# EAGLE design board_v1 (EAGLE 9.4.0)
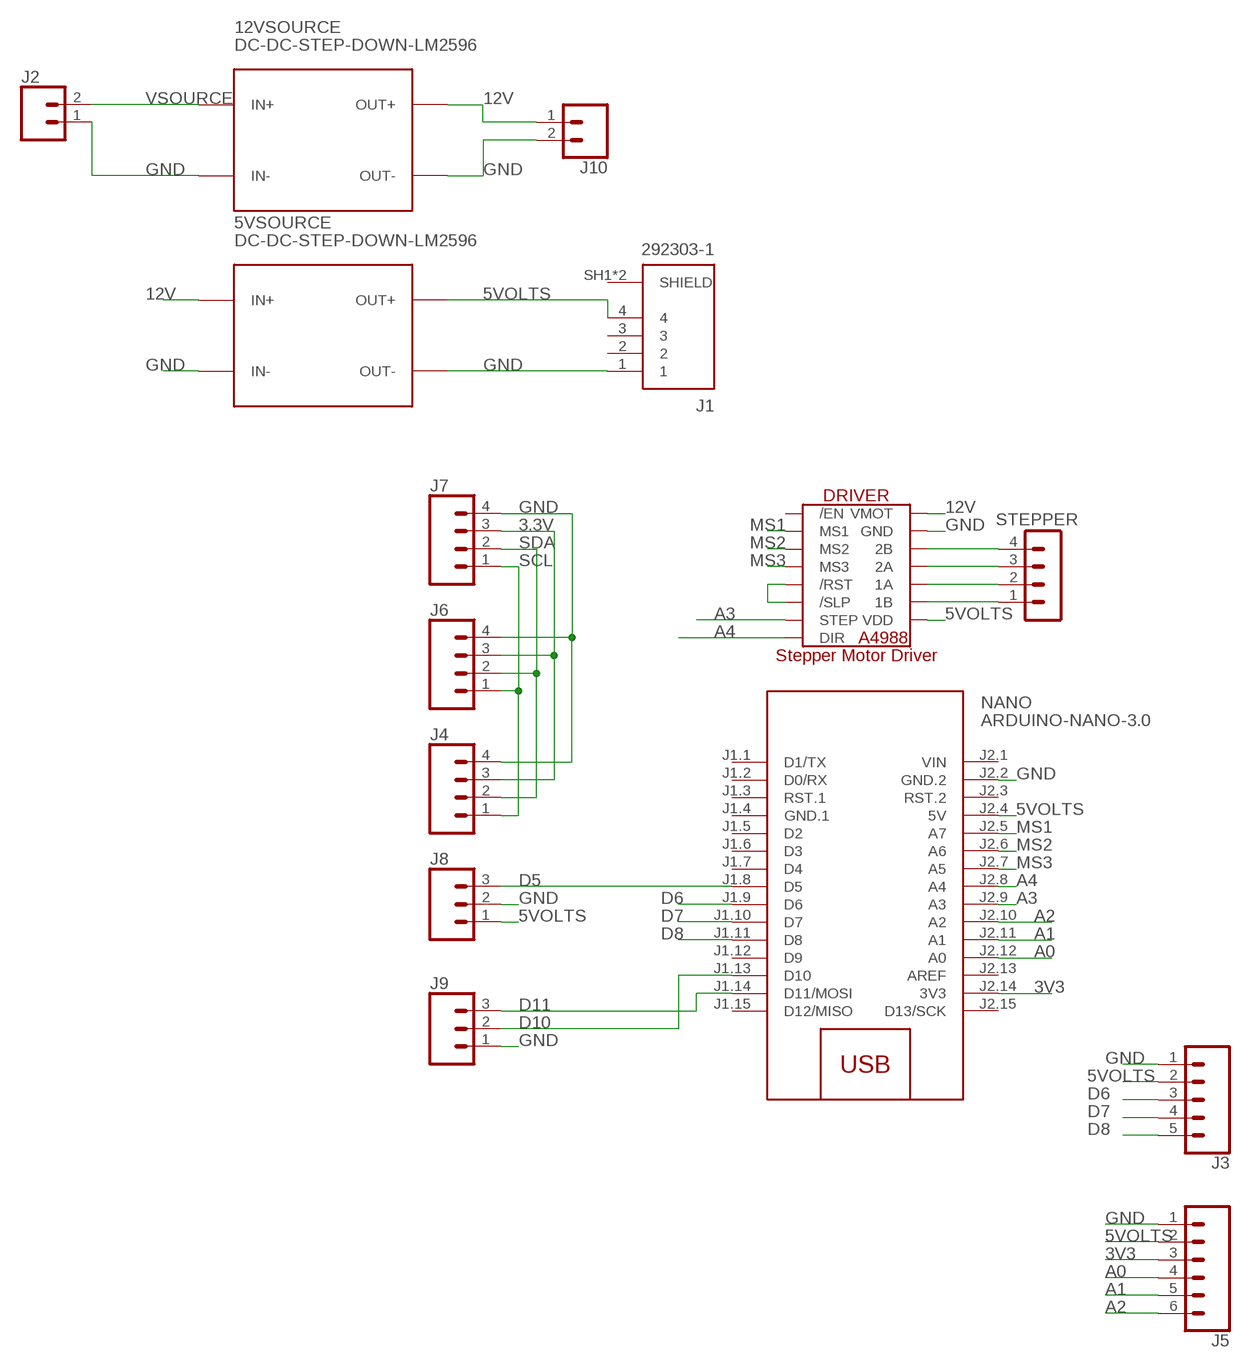
[diagram p0: schematic, sheet 1]

## Parts
5VSOURCE  DC-DC-STEP-DOWN-LM2596  [DC-DC-STEP-DOWN-LM2596]
12VSOURCE  DC-DC-STEP-DOWN-LM2596  [DC-DC-STEP-DOWN-LM2596]
DRIVER  A4988_STEP  [A4988_STEP]
J1  292303-1  [292303-1]
J2  CONN_025MM  [SCREWTERMINAL-5MM-2]
J3  CONN_05  [1X05]
J4  CONN_04POLAR  [MOLEX-1X4]
J5  CONN_06SILK_FEMALE_PTH  [1X06]
J6  CONN_04POLAR  [MOLEX-1X4]
J7  CONN_04POLAR  [MOLEX-1X4]
J8  CONN_03POLAR  [MOLEX-1X3]
J9  CONN_03POLAR  [MOLEX-1X3]
J10  CONN_025MM  [SCREWTERMINAL-5MM-2]
NANO  ARDUINO-NANO-3.0  [ARDUINO-NANO-3.0]
STEPPER  MA04-1  [MA04-1]

## Nets
3.3V: J4.3 J6.3 J7.3
3V3: J5.3 NANO.J2.14(3V3)
5VOLTS: 5VSOURCE.OUT+ DRIVER.VDD J1.4 J3.2 J5.2 J8.1 NANO.J2.4(5V)
12V: 5VSOURCE.IN+ 12VSOURCE.OUT+ DRIVER.VMOT J10.1
A0: J5.4 NANO.J2.12(A0)
A1: J5.5 NANO.J2.11(A1)
A2: J5.6 NANO.J2.10(A2)
A3: DRIVER.STEP NANO.J2.9(A3)
A4: DRIVER.DIR NANO.J2.8(A4)
D5: J8.3 NANO.J1.8(D5)
D6: J3.3 NANO.J1.9(D6)
D7: J3.4 NANO.J1.10(D7)
D8: J3.5 NANO.J1.11(D8)
D10: J9.2 NANO.J1.13(D10)
D11: J9.3 NANO.J1.14(D11/MOSI)
GND: 5VSOURCE.IN- 5VSOURCE.OUT- 12VSOURCE.IN- 12VSOURCE.OUT- DRIVER.GND DRIVER.GND2(GND) J1.1 J2.1 J3.1 J4.4 J5.1 J6.4 J7.4 J8.2 J9.1 J10.2 NANO.J2.2(GND.2)
MS1: DRIVER.MS1 NANO.J2.5(A7)
MS2: DRIVER.MS2 NANO.J2.6(A6)
MS3: DRIVER.MS3 NANO.J2.7(A5)
N$2: DRIVER.2B STEPPER.4
N$6: DRIVER.2A STEPPER.3
N$7: DRIVER.1A STEPPER.2
N$8: DRIVER.1B STEPPER.1
N$10: DRIVER./RST DRIVER./SLP
SCL: J4.1 J6.1 J7.1
SDA: J4.2 J6.2 J7.2
VSOURCE: 12VSOURCE.IN+ J2.2
Unconnected: DRIVER./EN J1.2 J1.3 NANO.J1.1(D1/TX) NANO.J1.2(D0/RX) NANO.J1.3(RST.1) NANO.J1.5(D2) NANO.J1.6(D3) NANO.J1.7(D4) NANO.J1.12(D9) NANO.J1.15(D12/MISO) NANO.J2.3(RST.2) NANO.J2.13(AREF) NANO.J2.15(D13/SCK)

## Power pins joined to a net without a drawn wire
GND.1: NANO.J1.4(GND.1)
SHIELD: J1.SH1(SHIELD) J1.SH2(SHIELD)
VSOURCE: NANO.J2.1(VIN)

## Library data of the parts
5VSOURCE 12VSOURCE = diy-modules:DC-DC-STEP-DOWN-LM2596: DC/DC Step-Down Regulator based on LM2596-ADJ chip LM2596 datasheet available here: http://www.ti.com/lit/ds/symlink/lm2596.pdf Click here to find device on ebay.com <http://www.ebay.com/sch/lm2596+power+regulator>
DRIVER = IC:A4988_STEP
J1 = USB connector:292303-1: CONN RCPT USB2.0 TYPEA 4POS R/A Manufacturer's datasheet <https://www.te.com/commerce/DocumentDelivery/DDEController?Action=srchrtrv&DocNm=292303&DocType=Customer+Drawing&DocLang=English>; CREATED_BY: PCBLayout.com; DIGIKEY_PARTNO: A31726-ND; MANUFACTURER: TE Connectivity AMP Connectors; MPN: 292303-1
J2 J10 = SparkFun-Connectors:CONN_02: Multi connection point. Often used as Generic Header-pin footprint for 0.1 inch spaced/style header connections On any of the 0.1 inch spaced packages, you can populate with these: Break Away Headers - Straight <https://www.sparkfun.com/products/116> (PRT-00116) Break Away Male Headers - Right Angle <https://www.sparkfun.com/products/553> (PRT-00553) Female Headers <https://www.sparkfun.com/products/115> (PRT-00115) Break Away Headers - Machine Pin <https://www.sparkfun.com/products/117> (PRT-00117) Break Away Female Headers - Swiss Machine Pin <https://www.sparkfun.com/products/743> (PRT-00743) For SCREWTERMINALS and SPRING TERMINALS visit here: Screw Terimnals on SparkFun.com <https://www.sparkfun.com/search/results?term=Screw+Terminals> (5mm/3.5mm/2.54mm spacing) This device is also useful as a general connection point to wire up your design to another part of your project. Our various solder wires solder well into these plated through hole pads. Hook-Up Wire - Assortment (Stranded, 22 AWG) <https://www.sparkfun.com/products/11375> (PRT-11375) Hook-Up Wire - Assortment (Solid Core, 22 AWG) <https://www.sparkfun.com/products/11367> (PRT-11367) View the entire wire category on our website here <https://www.sparkfun.com/categories/141> Special notes: Molex polarized connector foot print use with: PRT-08233 with associated crimp pins and housings. 2.54_SCREWTERM for use with PRT-10571. 3.5mm Screw Terminal footprints for PRT-08084 5mm Screw Terminal footprints for use with PRT-08432; SF_SKU: PRT-08432
J3 = SparkFun-Connectors:CONN_05: Multi connection point. Often used as Generic Header-pin footprint for 0.1 inch spaced/style header connections On any of the 0.1 inch spaced packages, you can populate with these: Break Away Headers - Straight <https://www.sparkfun.com/products/116> (PRT-00116) Break Away Male Headers - Right Angle <https://www.sparkfun.com/products/553> (PRT-00553) Female Headers <https://www.sparkfun.com/products/115> (PRT-00115) Break Away Headers - Machine Pin <https://www.sparkfun.com/products/117> (PRT-00117) Break Away Female Headers - Swiss Machine Pin <https://www.sparkfun.com/products/743> (PRT-00743) For SCREWTERMINALS and SPRING TERMINALS visit here: Screw Terimnals on SparkFun.com <https://www.sparkfun.com/search/results?term=Screw+Terminals> (5mm/3.5mm/2.54mm spacing) This device is also useful as a general connection point to wire up your design to another part of your project. Our various solder wires solder well into these plated through hole pads. Hook-Up Wire - Assortment (Stranded, 22 AWG) <https://www.sparkfun.com/products/11375> (PRT-11375) Hook-Up Wire - Assortment (Solid Core, 22 AWG) <https://www.sparkfun.com/products/11367> (PRT-11367) View the entire wire category on our website here <https://www.sparkfun.com/categories/141> Special notes: Molex polarized connector foot print use with SKU : PRT-08231 with associated crimp pins and housings. 1MM SMD Version SKU: PRT-10208
J4 J6 J7 = SparkFun-Connectors:CONN_04: Multi connection point. Often used as Generic Header-pin footprint for 0.1 inch spaced/style header connections On any of the 0.1 inch spaced packages, you can populate with these: Break Away Headers - Straight <https://www.sparkfun.com/products/116> (PRT-00116) Break Away Male Headers - Right Angle <https://www.sparkfun.com/products/553> (PRT-00553) Female Headers <https://www.sparkfun.com/products/115> (PRT-00115) Break Away Headers - Machine Pin <https://www.sparkfun.com/products/117> (PRT-00117) Break Away Female Headers - Swiss Machine Pin <https://www.sparkfun.com/products/743> (PRT-00743) For SCREWTERMINALS and SPRING TERMINALS visit here: Screw Terimnals on SparkFun.com <https://www.sparkfun.com/search/results?term=Screw+Terminals> (5mm/3.5mm/2.54mm spacing) This device is also useful as a general connection point to wire up your design to another part of your project. Our various solder wires solder well into these plated through hole pads. Hook-Up Wire - Assortment (Stranded, 22 AWG) <https://www.sparkfun.com/products/11375> (PRT-11375) Hook-Up Wire - Assortment (Solid Core, 22 AWG) <https://www.sparkfun.com/products/11367> (PRT-11367) View the entire wire category on our website here <https://www.sparkfun.com/categories/141> Special notes: Molex polarized connector foot print use with SKU : PRT-08231 with associated crimp pins and housings. 1MM SMD Version SKU: PRT-10208; PROD_ID: CONN-08186; SF_ID: PRT-08231
J5 = SparkFun-Connectors:CONN_06: Multi connection point. Often used as Generic Header-pin footprint for 0.1 inch spaced/style header connections On any of the 0.1 inch spaced packages, you can populate with these: Break Away Headers - Straight <https://www.sparkfun.com/products/116> (PRT-00116) Break Away Male Headers - Right Angle <https://www.sparkfun.com/products/553> (PRT-00553) Female Headers <https://www.sparkfun.com/products/115> (PRT-00115) Break Away Headers - Machine Pin <https://www.sparkfun.com/products/117> (PRT-00117) Break Away Female Headers - Swiss Machine Pin <https://www.sparkfun.com/products/743> (PRT-00743) Arduino Stackable Header - 6 Pin <https://www.sparkfun.com/products/9280> (PRT-09280) For SCREWTERMINALS and SPRING TERMINALS visit here: Screw Terimnals on SparkFun.com <https://www.sparkfun.com/search/results?term=Screw+Terminals> (5mm/3.5mm/2.54mm spacing) This device is also useful as a general connection point to wire up your design to another part of your project. Our various solder wires solder well into these plated through hole pads. Hook-Up Wire - Assortment (Stranded, 22 AWG) <https://www.sparkfun.com/products/11375> (PRT-11375) Hook-Up Wire - Assortment (Solid Core, 22 AWG) <https://www.sparkfun.com/products/11367> (PRT-11367) View the entire wire category on our website here <https://www.sparkfun.com/categories/141>; PROD_ID: CONN-08437
J8 J9 = SparkFun-Connectors:CONN_03: Multi connection point. Often used as Generic Header-pin footprint for 0.1 inch spaced/style header connections On any of the 0.1 inch spaced packages, you can populate with these: Break Away Headers - Straight <https://www.sparkfun.com/products/116> (PRT-00116) Break Away Male Headers - Right Angle <https://www.sparkfun.com/products/553> (PRT-00553) Female Headers <https://www.sparkfun.com/products/115> (PRT-00115) Break Away Headers - Machine Pin <https://www.sparkfun.com/products/117> (PRT-00117) Break Away Female Headers - Swiss Machine Pin <https://www.sparkfun.com/products/743> (PRT-00743) Stackable Header - 3 Pin (Female, 0.1") <https://www.sparkfun.com/products/13875> (PRT-13875) For SCREWTERMINALS and SPRING TERMINALS visit here: Screw Terimnals on SparkFun.com <https://www.sparkfun.com/search/results?term=Screw+Terminals> (5mm/3.5mm/2.54mm spacing) This device is also useful as a general connection point to wire up your design to another part of your project. Our various solder wires solder well into these plated through hole pads. Hook-Up Wire - Assortment (Stranded, 22 AWG) <https://www.sparkfun.com/products/11375> (PRT-11375) Hook-Up Wire - Assortment (Solid Core, 22 AWG) <https://www.sparkfun.com/products/11367> (PRT-11367) View the entire wire category on our website here <https://www.sparkfun.com/categories/141> Special notes: Molex polarized connector foot print use with SKU : PRT-08232 with associated crimp pins and housings.; PROD_ID: CONN-08625; SF_ID: PRT-08096
NANO = diy-modules:ARDUINO-NANO-3.0: Arduino Nano 3.0 and compatible devices More details available here: https://www.arduino.cc/en/Main/ArduinoBoardNano Click here to find device on ebay.com <http://www.ebay.com/sch/arduino+nano>
STEPPER = con-lstb:MA04-1: PIN HEADER; OC_FARNELL: unknown; OC_NEWARK: unknown

## Board
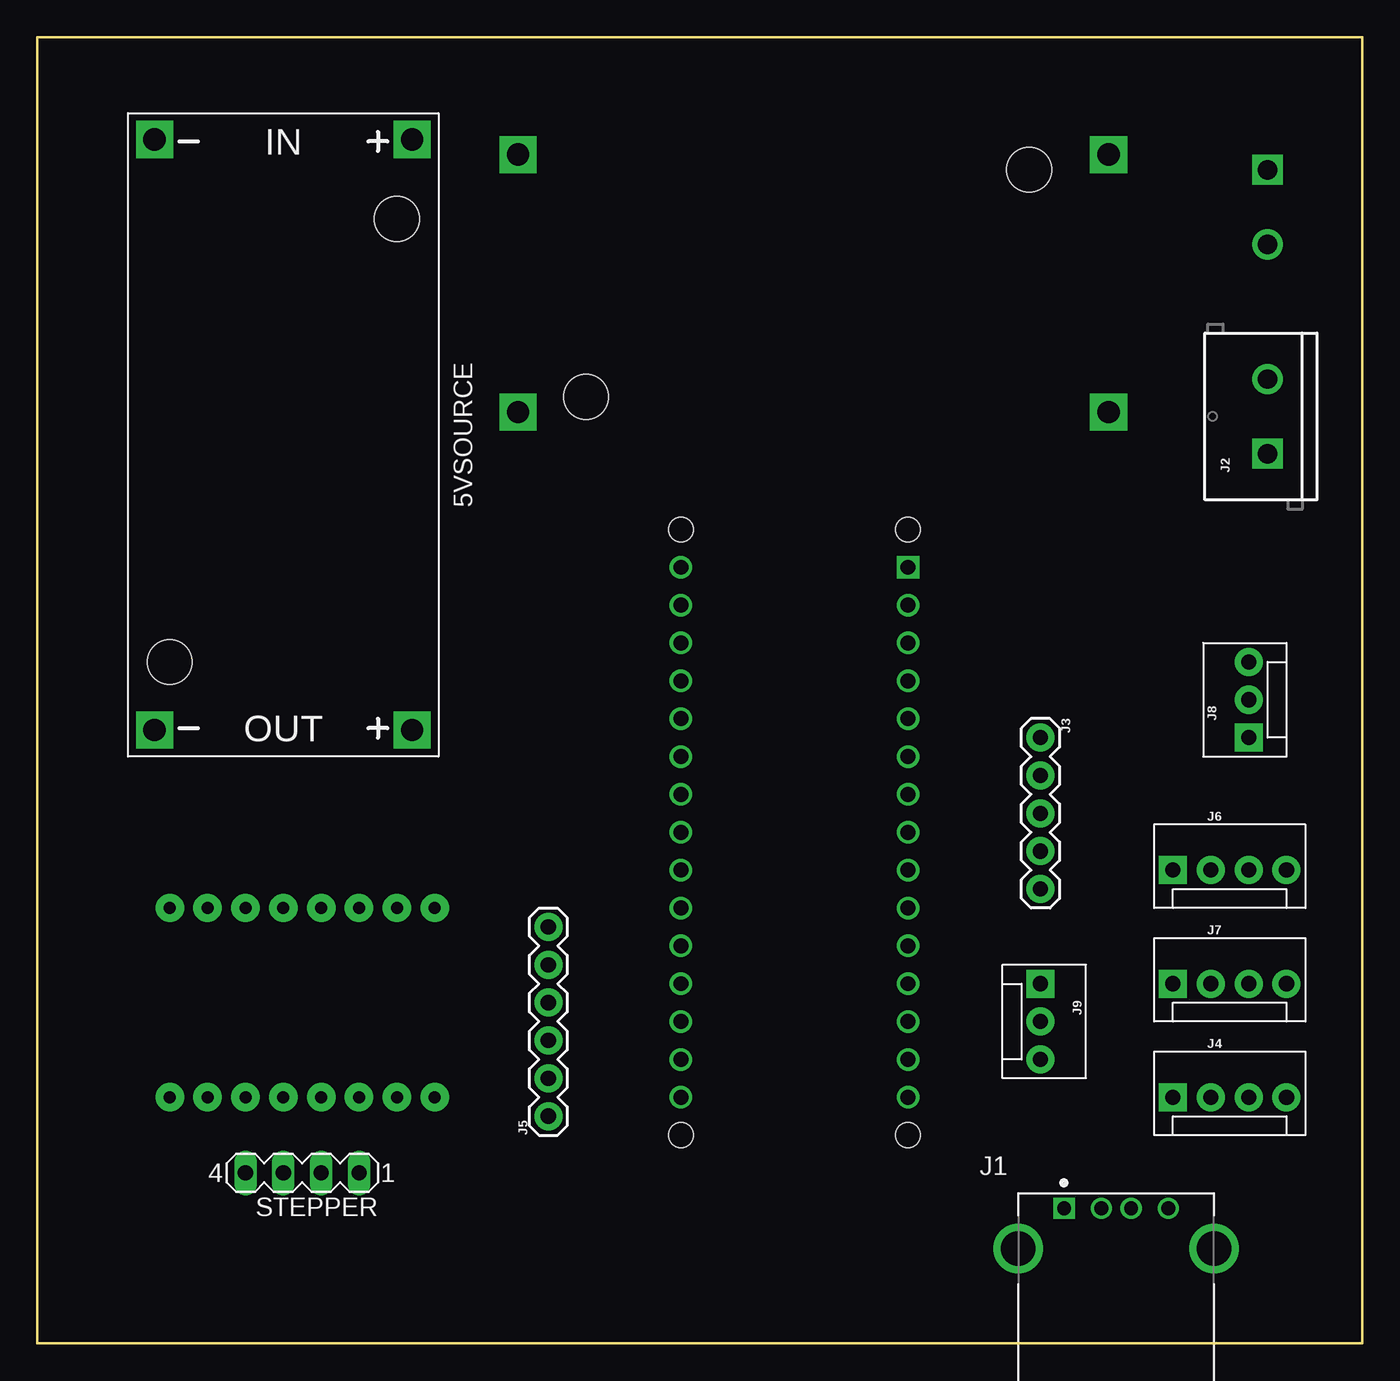
[diagram p1: board, top side]
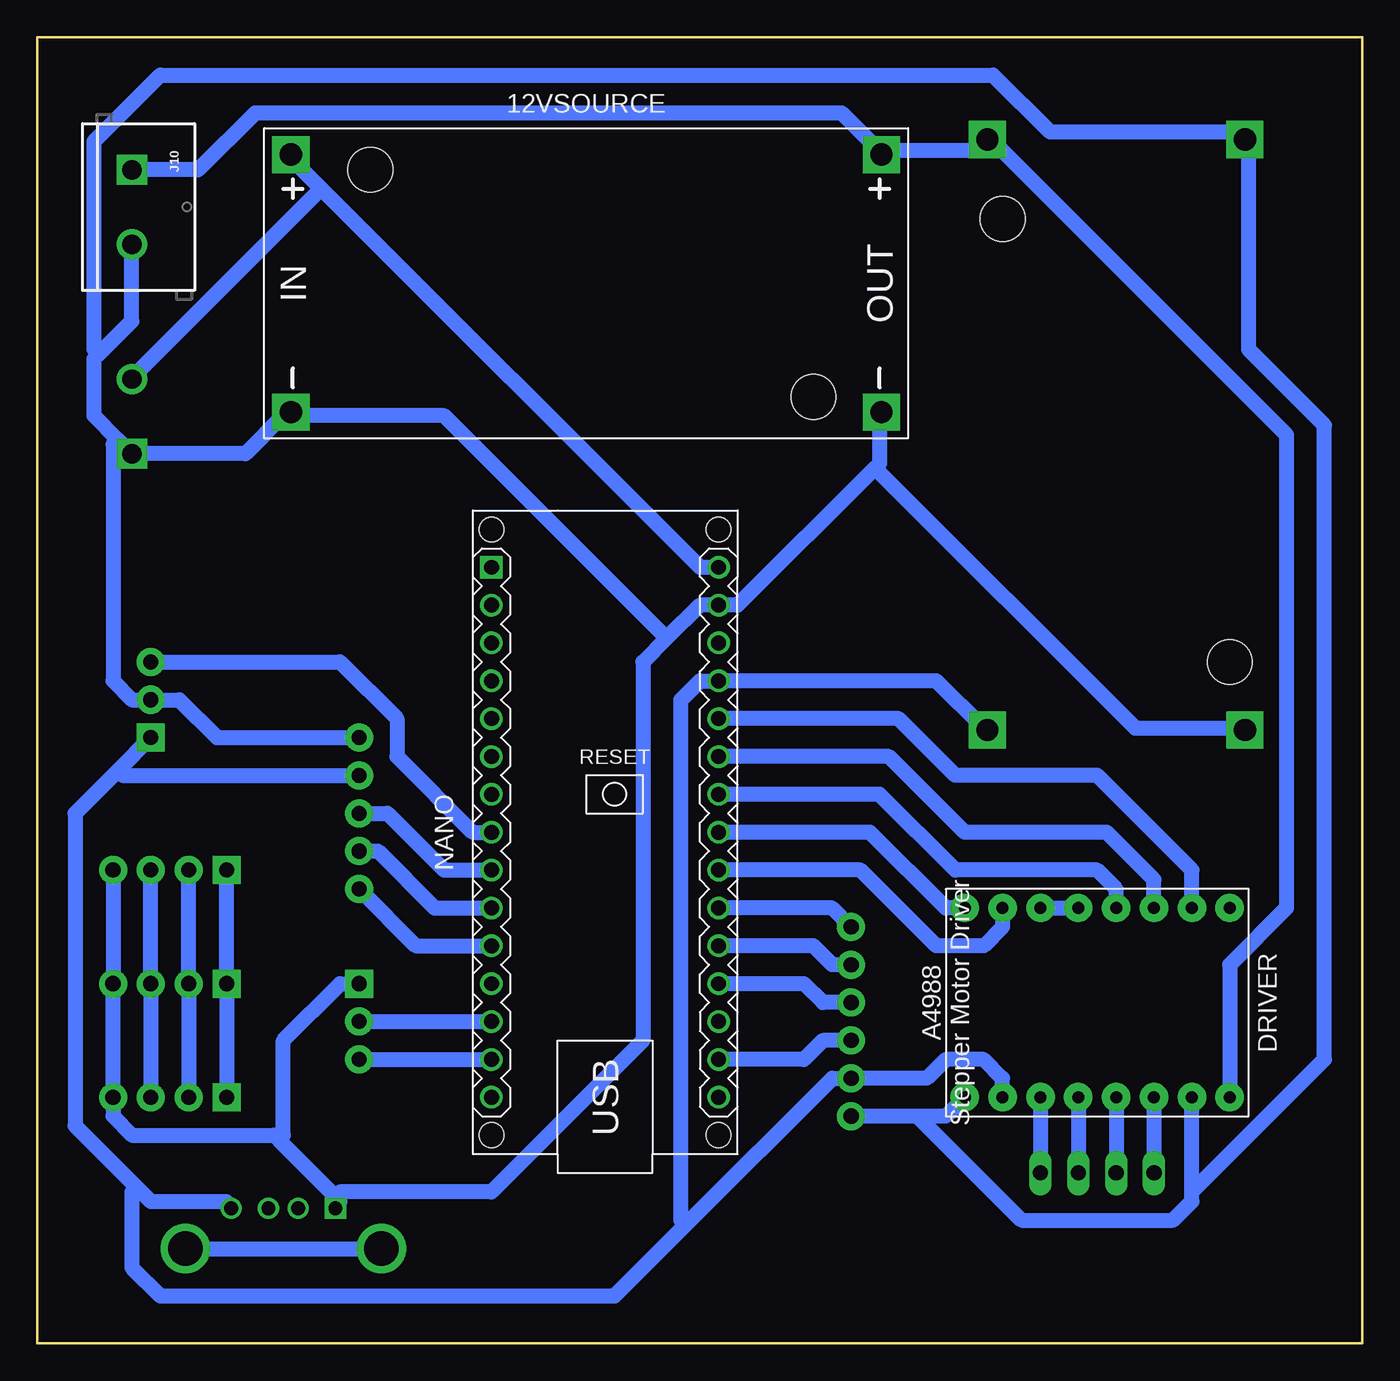
[diagram p2: board, bottom side, seen from below]

Size 88.9 x 87.63 mm. Coordinates in mm from the lower left corner, seen from the top.
Outline: 0,87.63 0,0 88.9,0 88.9,87.63 0,87.63
Copper layers (1*16): Top 0.035mm / dielectric 1.5mm / Bottom 0.035mm
Design rules "default *": minimum track width 1mm, minimum drill 0.8mm, track to track 1mm, track to pad 1mm, pad to pad 1mm, via to via 1mm, smd to smd 6mil, copper to edge 40mil, drill to drill 6mil, minimum pad ring 10mil, minimum via ring 8mil, stop-mask expansion 4mil, vias tented up to drill 0mil, thermal gap 10mil

### Footprints (pad centres in the part's own frame; a part is rotated, then mirrored left to right if it is on the bottom)
DC-DC-STEP-DOWN-LM2596 = drill 1.5 pad 2.5 square: IN+ -19.812,8.636; IN- -19.812,-8.636; OUT+ 19.812,8.636; OUT- 19.812,-8.636 | hole 3: -14.478,7.62; 15.24,-7.62
A4988_STEP = drill 0.8 pad 1.905: 1A 6.35,-1.27; 1B 6.35,-3.81; 2A 6.35,1.27; 2B 6.35,3.81; /EN -6.35,8.89; /RST -6.35,-1.27; /SLP -6.35,-3.81; DIR -6.35,-8.89; GND 6.35,6.35; GND2 6.35,-8.89; MS1 -6.35,6.35; MS2 -6.35,3.81; MS3 -6.35,1.27; STEP -6.35,-6.35; VDD 6.35,-6.35; VMOT 6.35,8.89
292303-1 = drill 0.92 square: 1 -3.5,2.71 | drill 0.92: 2 -1,2.71; 3 1,2.71; 4 3.5,2.71 | drill 2.3: SH1 -6.57,0; SH2 6.57,0
SCREWTERMINAL-5MM-2 = drill 1.3 pad 2.032 square: 1 0,0 | drill 1.3 pad 2.032: 2 5,0
1X05 = drill 1.016 pad 1.88: 1 0,0; 2 2.54,0; 3 5.08,0; 4 7.62,0; 5 10.16,0
MOLEX-1X4 = drill 1.016 pad 1.88 square: 1 0,0 | drill 1.016 pad 1.88: 2 2.54,0; 3 5.08,0; 4 7.62,0
1X06 = drill 1.016 pad 1.88: 1 0,0; 2 2.54,0; 3 5.08,0; 4 7.62,0; 5 10.16,0; 6 12.7,0
MOLEX-1X3 = drill 1.016 pad 1.88 square: 1 0,0 | drill 1.016 pad 1.88: 2 2.54,0; 3 5.08,0
ARDUINO-NANO-3.0 = drill 1 square: J1.1 17.78,7.62 | drill 1: J1.2 15.24,7.62; J1.3 12.7,7.62; J1.4 10.16,7.62; J1.5 7.62,7.62; J1.6 5.08,7.62; J1.7 2.54,7.62; J1.8 0,7.62; J1.9 -2.54,7.62; J1.10 -5.08,7.62; J1.11 -7.62,7.62; J1.12 -10.16,7.62; J1.13 -12.7,7.62; J1.14 -15.24,7.62; J1.15 -17.78,7.62; J2.1 17.78,-7.62; J2.2 15.24,-7.62; J2.3 12.7,-7.62; J2.4 10.16,-7.62; J2.5 7.62,-7.62; J2.6 5.08,-7.62; J2.7 2.54,-7.62; J2.8 0,-7.62; J2.9 -2.54,-7.62; J2.10 -5.08,-7.62; J2.11 -7.62,-7.62; J2.12 -10.16,-7.62; J2.13 -12.7,-7.62; J2.14 -15.24,-7.62; J2.15 -17.78,-7.62 | hole 1.651: -20.32,7.62; -20.32,-7.62; 20.32,-7.62; 20.32,7.62
MA04-1 = drill 1.016 long: 1 -3.81,0; 2 -1.27,0; 3 1.27,0; 4 3.81,0

### Placement (x,y rotation side)
5VSOURCE  16.51,60.96 270 top
12VSOURCE  52.07,71.12 0 bottom
DRIVER  17.78,22.86 270 bottom
J1  72.39,6.35 0 top
J2  82.55,59.69 90 top
J3  67.31,40.64 270 top
J4  76.2,16.51 0 top
J5  34.29,15.24 90 top
J6  76.2,31.75 0 top
J7  76.2,24.13 0 top
J8  81.28,40.64 90 top
J9  67.31,24.13 270 top
J10  82.55,78.74 270 bottom
NANO  50.8,34.29 90 bottom
STEPPER  17.78,11.43 180 top

### Tracks (layer width: path | path; a pad name or v marks a point on that pad's centre or on a via)
3.3V
  Bottom 1: J4.3 J7.3 J6.3
3V3
  Bottom 1: NANO.J2.14 37.47,19.05 36.2,20.32 J5.3
5VOLTS
  Bottom 1: 5VSOURCE.OUT+ 25.4,41.28 28.57,44.45 NANO.J2.4 44.45,44.45 45.72,43.18 45.72,8.26 45.4,7.94 | DRIVER.VDD 24.13,17.78 25.4,19.05 27.94,19.05 29.21,17.78 J5.2 35.56,17.78 45.4,7.94 | 82.23,10.48 86.36,14.61 86.36,35.56 83.5,38.42 | 82.23,10.48 81.28,9.53 76.2,9.53 J1.4 | J8.1 83.5,38.42 | J3.2 83.19,38.1 83.5,38.42 | 45.4,7.94 50.17,3.18 80.64,3.18 82.55,5.08 82.55,10.16 82.23,10.48
12V
  Bottom 1: J10.1 78.11,78.74 74.3,82.55 34.92,82.55 32.39,80.01 12VSOURCE.OUT+ 31.75,80.01 24.76,80.01 5VSOURCE.IN+ 24.76,80.65 5.08,60.96 5.08,29.21 8.89,25.4 DRIVER.VMOT
A0
  Bottom 1: NANO.J2.12 37.47,24.13 36.2,22.86 J5.4
A1
  Bottom 1: NANO.J2.11 36.83,26.67 35.56,25.4 J5.5
A2
  Bottom 1: NANO.J2.10 35.56,29.21 J5.6
A3
  Bottom 1: NANO.J2.9 33.66,31.75 28.57,26.67 25.4,26.67 24.13,27.94 DRIVER.STEP
A4
  Bottom 1: NANO.J2.8 33.02,34.29 27.94,29.21 DRIVER.DIR
D5
  Bottom 1: NANO.J1.8 59.69,34.29 64.77,39.37 64.77,41.91 68.58,45.72 J8.3
D6
  Bottom 1: NANO.J1.9 61.59,31.75 65.41,35.56 J3.3
D7
  Bottom 1: NANO.J1.10 62.23,29.21 66.04,33.02 J3.4
D8
  Bottom 1: NANO.J1.11 63.5,26.67 J3.5
D10
  Bottom 1: J9.2 NANO.J1.13
D11
  Bottom 1: J9.3 NANO.J1.14
GND
  Bottom 1: 29.84,15.24 27.94,15.24 DRIVER.GND2 | 29.84,15.24 J5.1 | 11.43,10.16 11.43,9.53 12.7,8.26 22.86,8.26 29.84,15.24 | 11.43,10.16 DRIVER.GND | 11.43,10.16 2.54,19.05 2.54,61.6 7.62,66.68 7.62,80.65 5VSOURCE.IN- 8.25,81.28 20.96,81.28 24.76,85.09 80.64,85.09 85.09,80.65 85.09,66.68 84.77,66.36 | J3.1 76.84,40.64 79.38,43.18 J8.2 82.55,43.18 83.82,44.45 83.82,60.33 83.5,60.64 | J10.2 82.55,68.58 84.77,66.36 | 84.77,66.36 85.09,66.04 85.09,62.23 83.5,60.64 | 83.5,60.64 J2.1 74.93,59.69 72.39,62.23 12VSOURCE.IN- 71.75,62.23 61.59,62.23 46.67,47.31 | J6.4 J7.4 J4.4 83.82,15.24 82.55,13.97 73.03,13.97 72.71,13.65 | 72.71,13.65 68.9,9.84 | 68.9,9.84 68.58,9.53 J1.1 | J9.1 68.58,24.13 72.39,20.32 72.39,13.97 72.71,13.65 | 32.7,58.74 32.39,59.06 32.39,62.23 12VSOURCE.OUT- | 32.7,58.74 41.91,49.53 NANO.J2.2 44.45,49.53 46.67,47.31 | 32.7,58.74 15.24,41.28 8.25,41.28 5VSOURCE.OUT- | 46.67,47.31 48.26,45.72 48.26,20.32 58.42,10.16 68.58,10.16 68.9,9.84
MS1
  Bottom 1: NANO.J2.5 31.11,41.91 27.3,38.1 17.78,38.1 11.43,31.75 DRIVER.MS1
MS2
  Bottom 1: NANO.J2.6 31.75,39.37 26.67,34.29 17.14,34.29 13.97,31.12 DRIVER.MS2
MS3
  Bottom 1: NANO.J2.7 32.39,36.83 27.3,31.75 17.78,31.75 16.51,30.48 DRIVER.MS3
N$2
  Bottom 1: DRIVER.2B STEPPER.4
N$6
  Bottom 1: DRIVER.2A STEPPER.3
N$7
  Bottom 1: DRIVER.1A STEPPER.2
N$8
  Bottom 1: DRIVER.1B STEPPER.1
N$10
  Bottom 1: DRIVER./SLP DRIVER./RST
SCL
  Bottom 1: J4.1 J7.1 J6.1
SDA
  Bottom 1: J4.2 J7.2 J6.2
SHIELD
  Bottom 1: J1.SH2 J1.SH1
VSOURCE
  Bottom 1: NANO.J2.1 44.45,52.07 69.85,77.47 | 69.85,77.47 71.75,79.38 12VSOURCE.IN+ | 69.85,77.47 82.55,64.77 J2.2